# EAGLE design PCA9540BD_big_breakout (EAGLE 7.3.0)
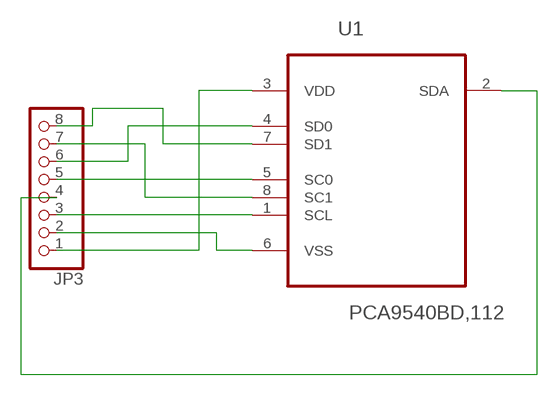
[diagram p0: schematic, sheet 1]

## Parts
JP3  PINHD-1X8  [1X08]
U1  PCA9540BD,112  [SOIC127P600X175-8N]

## Nets
N$1: JP3.1 U1.3(VDD)
N$2: JP3.2 U1.6(VSS)
N$3: JP3.3 U1.1(SCL)
N$4: JP3.4 U1.2(SDA)
N$5: JP3.5 U1.5(SC0)
N$6: JP3.6 U1.4(SD0)
N$7: JP3.7 U1.8(SC1)
N$8: JP3.8 U1.7(SD1)

## Library data of the parts
JP3 = pinhead:PINHD-1X8: PIN HEADER
U1 = NXP_By_element14_Batch_1:PCA9540BD,112: 2-channel I2C-bus multiplexer; MPN: PCA9540BD,112; OC_FARNELL: 1831206; OC_NEWARK: 70R6561; PACKAGE: SOIC-8; SUPPLIER: NXP

## Board
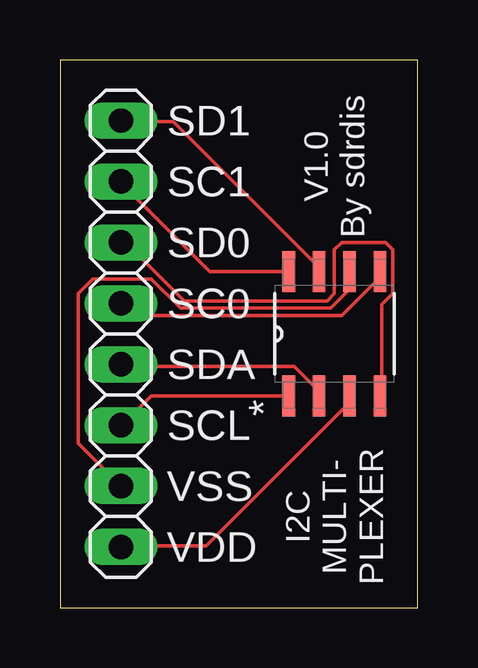
[diagram p1: board, top side]

Size 14.91 x 22.85 mm. Coordinates in mm from the lower left corner, seen from the top.
Outline: 0,0 14.91,0 14.91,22.85 0,22.85 0,0
Copper layers (1*16): Top 0.035mm / dielectric 1.5mm / Bottom 0.035mm
Design rules "SeeedStudio_2layer_DRU_no_angle_20140221": minimum track width 6mil, minimum drill 12mil, track to track 6mil, track to pad 6mil, pad to pad 6mil, via to via 6mil, smd to smd 0mil, copper to edge 10mil, drill to drill 10mil, minimum pad ring 10mil, minimum via ring 6mil, stop-mask expansion 2mil, vias tented up to drill 100mil, thermal gap 10mil

### Footprints (pad centres in the part's own frame; a part is rotated, then mirrored left to right if it is on the bottom)
1X08 = drill 1.016 long: 1 -8.89,0; 2 -6.35,0; 3 -3.81,0; 4 -1.27,0; 5 1.27,0; 6 3.81,0; 7 6.35,0; 8 8.89,0
SOIC127P600X175-8N = smd 1.702 x 0.533: 1 -2.591,1.905; 2 -2.591,0.635; 3 -2.591,-0.635; 4 -2.591,-1.905; 5 2.591,-1.905; 6 2.591,-0.635; 7 2.591,0.635; 8 2.591,1.905

### Placement (x,y rotation side)
JP3  2.54,11.43 90 top
U1  11.43,11.43 90 top

### Tracks (layer width: path | path; a pad name or v marks a point on that pad's centre or on a via)
N$1
  Top 0.152: U1.3 12.04,8.84 12.04,8.53 6.1,2.59 2.59,2.59 JP3.1
N$2
  Top 0.152: JP3.2 0.76,6.86 0.76,13.11 1.37,13.72 3.81,13.72 5.03,12.5 11.28,12.5 12.04,13.26 12.04,14.02 U1.6
N$3
  Top 0.152: U1.1 3.81,8.84 2.59,7.62 JP3.3
N$4
  Top 0.152: U1.2 10.67,8.84 10.67,9.14 9.75,10.06 2.59,10.06 JP3.4
N$5
  Top 0.152: JP3.5 3.05,12.19 11.73,12.19 13.26,13.72 13.26,14.02 U1.5
N$6
  Top 0.152: JP3.6 2.74,15.24 5.18,12.8 11.12,12.8 11.43,13.11 11.43,14.94 11.73,15.24 13.56,15.24 13.87,14.94 13.87,13.11 13.41,12.65 13.41,8.84 U1.4
N$7
  Top 0.152: U1.8 6.25,14.02 2.59,17.68 JP3.7
N$8
  Top 0.152: U1.7 10.67,14.02 10.67,14.33 4.72,20.27 2.59,20.27 JP3.8

### Text on the board
tNames: SD1 | V1.0 / By sdrdis | SC1 | SD0 | SC0 | SDA | SCL | VSS | I2C / MULTI- / PLEXER | VDD